# Altium schematic sheet 3v3_Regulator.SchDoc: 3.3 Regulator
size A4; Organization: Altium Limited; Address1: L3, 12a Rodborough Rd; Address2: Frenchs Forest; Address3: NSW; Address4: Australia 2086
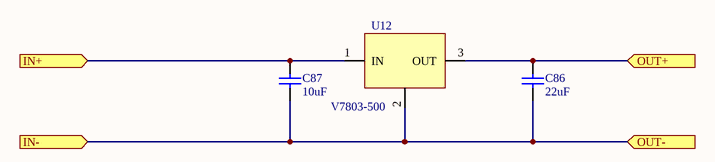
[diagram p0: 3v3_Regulator.SchDoc]

## Parts
C86  22uF  [STD_0805_C]
C87  10uF  [STD_0805_C]
U12  V7803-500  [V78-500]

## Ports
IN+ (in), IN- (in), OUT+ (in), OUT- (in)

## Nets
IN+: C87.2 U12.1(IN) ; port IN+
IN-: C86.1 C87.1 U12.2(GND) ; port IN-, port OUT-
OUT+: C86.2 U12.3(OUT) ; port OUT+

## Notes on the sheet
- Title
- Date:
- RE:
- Arturo di Girolamo
- Size:
- A3
- A

## Library data of the parts
C86 C87 = GRM21BR61E226ME44L: Capacitor, 22uF, 0805, 25V; Value: .01uf; ASYPN: C2012X5R1V226M125AC; MFGPN: GRM21BR61E226ME44L